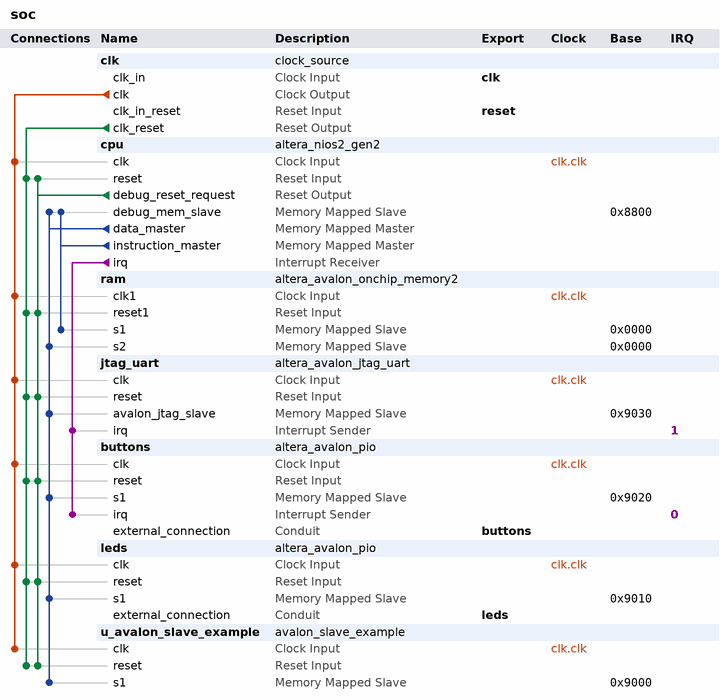
[diagram p0: system contents]
# Platform Designer (Qsys) system soc, Cyclone IV E EP4CE22F17C6
# Parameters at their usual value, and those the tool derives, are not listed.
package require -exact qsys 18.1
create_system soc
set_project_property DEVICE_FAMILY {Cyclone IV E}
set_project_property DEVICE EP4CE22F17C6

add_instance clk clock_source 18.1
set_instance_parameter_value clk clockFrequency 50000000

add_instance cpu altera_nios2_gen2 18.1
set_instance_parameter_value cpu dcache_size 2048
set_instance_parameter_value cpu exceptionSlave ram.s1
set_instance_parameter_value cpu icache_size 4096
set_instance_parameter_value cpu impl Tiny
set_instance_parameter_value cpu resetSlave ram.s1

add_instance ram altera_avalon_onchip_memory2 18.1
set_instance_parameter_value ram dataWidth 32
set_instance_parameter_value ram dualPort true
set_instance_parameter_value ram initMemContent false
set_instance_parameter_value ram initializationFileName onchip_mem.hex
set_instance_parameter_value ram memorySize 32768
set_instance_parameter_value ram singleClockOperation true

add_instance jtag_uart altera_avalon_jtag_uart 18.1
set_instance_parameter_value jtag_uart simInteractiveOptions NO_INTERACTIVE_WINDOWS

add_instance buttons altera_avalon_pio 18.1
set_instance_parameter_value buttons captureEdge true
set_instance_parameter_value buttons direction Input
set_instance_parameter_value buttons generateIRQ true
set_instance_parameter_value buttons irqType EDGE
set_instance_parameter_value buttons width 1

add_instance leds altera_avalon_pio 18.1
set_instance_parameter_value leds direction Output
set_instance_parameter_value leds width 8

add_instance u_avalon_slave_example avalon_slave_example 1.0

# connections
add_connection clk.clk buttons.clk clock
add_connection clk.clk cpu.clk clock
add_connection clk.clk jtag_uart.clk clock
add_connection clk.clk leds.clk clock
add_connection clk.clk ram.clk1 clock
add_connection clk.clk u_avalon_slave_example.clk clock
add_connection clk.clk_reset buttons.reset reset
add_connection clk.clk_reset cpu.reset reset
add_connection clk.clk_reset jtag_uart.reset reset
add_connection clk.clk_reset leds.reset reset
add_connection clk.clk_reset ram.reset1 reset
add_connection clk.clk_reset u_avalon_slave_example.reset reset
add_connection cpu.debug_reset_request buttons.reset reset
add_connection cpu.debug_reset_request cpu.reset reset
add_connection cpu.debug_reset_request jtag_uart.reset reset
add_connection cpu.debug_reset_request leds.reset reset
add_connection cpu.debug_reset_request ram.reset1 reset
add_connection cpu.debug_reset_request u_avalon_slave_example.reset reset
add_connection cpu.data_master buttons.s1 avalon
set_connection_parameter_value cpu.data_master/buttons.s1 baseAddress 0x9020
add_connection cpu.data_master cpu.debug_mem_slave avalon
set_connection_parameter_value cpu.data_master/cpu.debug_mem_slave baseAddress 0x8800
add_connection cpu.data_master jtag_uart.avalon_jtag_slave avalon
set_connection_parameter_value cpu.data_master/jtag_uart.avalon_jtag_slave baseAddress 0x9030
add_connection cpu.data_master leds.s1 avalon
set_connection_parameter_value cpu.data_master/leds.s1 baseAddress 0x9010
add_connection cpu.data_master ram.s2 avalon
set_connection_parameter_value cpu.data_master/ram.s2 baseAddress 0x0000
add_connection cpu.data_master u_avalon_slave_example.s1 avalon
set_connection_parameter_value cpu.data_master/u_avalon_slave_example.s1 baseAddress 0x9000
add_connection cpu.instruction_master cpu.debug_mem_slave avalon
set_connection_parameter_value cpu.instruction_master/cpu.debug_mem_slave baseAddress 0x8800
add_connection cpu.instruction_master ram.s1 avalon
set_connection_parameter_value cpu.instruction_master/ram.s1 baseAddress 0x0000
add_connection cpu.irq buttons.irq interrupt
set_connection_parameter_value cpu.irq/buttons.irq irqNumber 0
add_connection cpu.irq jtag_uart.irq interrupt
set_connection_parameter_value cpu.irq/jtag_uart.irq irqNumber 1

# exported interfaces
add_interface buttons conduit end
set_interface_property buttons EXPORT_OF buttons.external_connection
add_interface clk clock sink
set_interface_property clk EXPORT_OF clk.clk_in
add_interface leds conduit end
set_interface_property leds EXPORT_OF leds.external_connection
add_interface reset reset sink
set_interface_property reset EXPORT_OF clk.clk_in_reset

set_interconnect_requirement {$system} qsys_mm.clockCrossingAdapter HANDSHAKE
set_interconnect_requirement {$system} qsys_mm.enableEccProtection FALSE
set_interconnect_requirement {$system} qsys_mm.insertDefaultSlave FALSE
set_interconnect_requirement {$system} qsys_mm.maxAdditionalLatency 1

save_system soc.qsys
